# Altium schematic sheet 18650 Charging.SchDoc
size A4
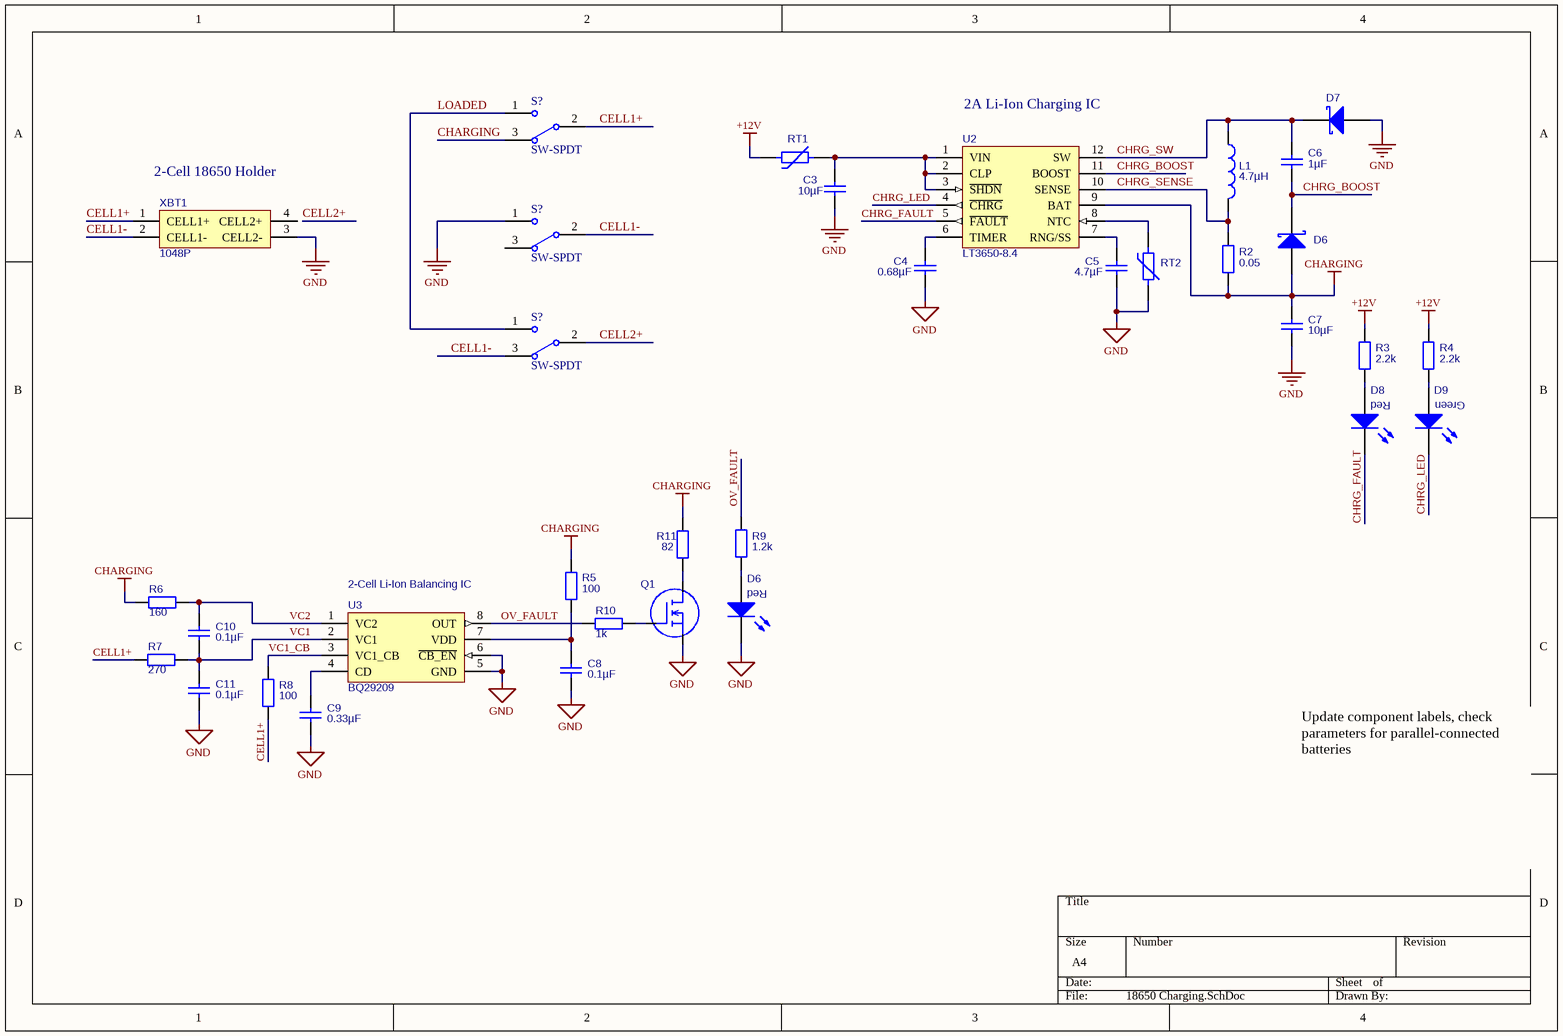
[diagram p0: 18650 Charging.SchDoc]

## Parts
(Parts that share a designator on the sheet are numbered #1, #2 ... from top to bottom, then left to right.)
C3  value 10µF  [TDK C-Series (3216)]
C4  value 0.68µF  [TDK C-Series (1608)]
C5  value 4.7µF  [TDK C-Series (2012)]
C6  value 1µF  [TDK C-Series (1608)]
C7  value 10µF  [TDK C-Series (3216)]
C8  value 0.1µF  [TDK C-Series (1608)]  (hidden comment: Cap)
C9  value 0.33µF  [TDK C-Series (1608)]  (hidden comment: Cap)
C10  value 0.1µF  [TDK C-Series (1608)]  (hidden comment: Cap)
C11  value 0.1µF  [TDK C-Series (1608)]  (hidden comment: Cap)
D6#1  D Schottky  [NXP PMEG6020AELRX (SOD-123)]  (value not drawn)
D6#2  LTST-C193KGKT-5A  [Lite-On LTST-C193K-Series (1608)]  (value not drawn)
D7  D Schottky  [NXP PMEG6020AELRX (SOD-123)]  (value not drawn)
D8  LTST-C193KGKT-5A  [Lite-On LTST-C193K-Series (1608)]  (value not drawn)
D9  LTST-C193KGKT-5A  [Lite-On LTST-C193K-Series (1608)]  (value not drawn)
L1  value 4.7µH  [Bourns SRU8028-Series]  (hidden comment: Inductor)
Q1  NX3020NAKW  [NXP NX3020NAKW (SOT-323)]  (value not drawn)
R2  value 0.05  [Panasonic ERJ-Series (1608)]
R3  value 2.2k  [Panasonic ERJ-Series (1608)]
R4  value 2.2k  [Panasonic ERJ-Series (1608)]
R5  value 100  [Panasonic ERJ-Series (1608)]
R6  value 160  [Panasonic ERJ-Series (1608)]
R7  value 270  [Panasonic ERJ-Series (1608)]
R8  value 100  [Panasonic ERJ-Series (1608)]
R9  value 1.2k  [Panasonic ERJ-Series (1608)]
R10  value 1k  [Panasonic ERJ-Series (1608)]
R11  value 82  [TE 3521-Series (6432)]
RT1  Thermistor  [Bel Fuse 0ZCG-Series (4532)]  (value not drawn)
RT2  Thermistor  [TDK NTCG-Series (1608)]  (value not drawn)
S?#1  SW-SPDT  [TL36WW15050]
S?#2  SW-SPDT  [TL36WW15050]
S?#3  SW-SPDT  [TL36WW15050]
U2  LT3650-8.4  [Linear Technology LT3650-8.4 (12-TSSOP)]
U3  BQ29209  [TI BQ29209 (8-VDFN)]
XBT1  1048P  [KEYSTONE 1048P]

## Nets
+12V: R3.2 R4.2 RT1.1
CHARGING: C7.1 D6#1.1(A) R2.1 R5.1 R6.2 R11.2 S?#1.3 U2.9(BAT)
GND: C3.2 C4.2 C5.2 C7.2 C8.2 C9.2 C11.2 D6#2.2(K) D7.1(A) Q1.2(SOURCE) RT2.2 S?#2.1 U3.5(GND) U3.6(~{CB_EN}) XBT1.3(CELL2-)
CELL1+: R7.2 R8.2 S?#1.2 XBT1.1(CELL1+)
CELL1-: S?#2.2 S?#3.3 XBT1.2(CELL1-)
CELL2+: S?#3.2
CHRG_BOOST: C6.1 D6#1.2(K) U2.11(BOOST)
CHRG_FAULT: D8.2(K) U2.5(~{FAULT})
CHRG_LED: D9.2(K) U2.4(~{CHRG})
CHRG_SENSE: L1.2 R2.2 U2.10(SENSE)
CHRG_SW: C6.2 D7.2(K) L1.1 U2.12(SW)
LOADED: S?#1.1 S?#3.1
OV_FAULT: R9.2 R10.1 U3.8(OUT)
VC1: C10.2 C11.1 R7.1 U3.2(VC1)
VC1_CB: R8.1 U3.3(VC1_CB)
VC2: C10.1 R6.1 U3.1(VC2)
NetC3_1: C3.1 RT1.2 U2.1(VIN) U2.2(CLP) U2.3(~{SHDN})
NetC4_1: C4.1 U2.6(TIMER)
NetC5_1: C5.1 U2.7(RNG/SS)
NetC8_1: C8.1 R5.2 U3.7(VDD)
NetC9_1: C9.1 U3.4(CD)
NetD6#2_1: D6#2.1(A) R9.1
NetD8_1: D8.1(A) R3.1
NetD9_1: D9.1(A) R4.1
NetQ1_1: Q1.1(GATE) R10.2
NetQ1_3: Q1.3(DRAIN) R11.1
NetRT2_1: RT2.1 U2.8(NTC)

Not connected (* = marked no-connect by the designer): S?#2 3; XBT1 4(CELL2+)

## Notes on the sheet
- (near U2) 2A Li-Ion Charging IC
- (near XBT1) 2-Cell 18650 Holder
- (near D8) Red
- (near D9) Green
- (near U3) 2-Cell Li-Ion Balancing IC
- (near D6#2) Red
- Update component labels, check parameters for parallel-connected batteries

## Library data of the parts
C3-C11 = Cap: Capacitor; Published: 8-Jun-2000; LatestRevisionDate: 17-Jul-2002; LatestRevisionNote: Re-released for DXP Platform.; PackageReference: RAD-0.3; Publisher: Altium Limited; PackageDescription: Radial Cap, Thru-Hole; 2 Leads; 0.3 in Pin Spacing; Supplier 1: Digi-Key
  C3 C7: Supplier Part Number 1: 445-7705-1-ND
  C4: Supplier Part Number 1: 445-5129-1-ND
  C5: Supplier Part Number 1: 445-6859-1-ND
  C6: Supplier Part Number 1: 445-5956-1-ND
  C8 C10 C11: Supplier Part Number 1: 445-1316-1-ND
  C9: Supplier Part Number 1: 445-5126-1-ND
D6#1 D7 = D Schottky: Schottky Diode; pin to pad: 1>2 2>1; Published: 8-Jun-2000; LatestRevisionDate: 17-Jul-2002; LatestRevisionNote: Re-released for DXP Platform.; Publisher: Altium Limited; Supplier 1: Digi-Key; Supplier Part Number 1: 568-12710-1-ND
D6#2 D8 D9 = LED0: Typical INFRARED GaAs LED; Published: 8-Jun-2000; LatestRevisionDate: 08-Jul-2005; LatestRevisionNote: Mech Layer 1 removed.; PackageReference: LED-0; Publisher: Altium Limited; PackageDescription: LED; 2 Leads; Supplier 1: Digi-Key
  D6#2 D8: Supplier Part Number 1: 160-1830-1-ND
  D9: Supplier Part Number 1: 160-1828-1-ND
L1 = Inductor: Code_IEC: 1005; Published: 8-Jun-2000; LatestRevisionDate: 29-May-2009; LatestRevisionNote: IPC-7351 Footprint Added.; PackageReference: 0402-A; Publisher: Altium Limited; PackageDescription: Chip Inductor; Code_JEITA: 0402; Supplier 1: Digi-Key; Supplier Part Number 1: SRU8028-4R7YCT-ND
Q1 = NXP NX3020NAKW: 30V 200mA N-MOSFET; Supplier 1: Digi-Key; Supplier Part Number 1: 568-10508-1-ND
R2-R11 = Res2: Resistor; Published: 8-Jun-2000; LatestRevisionDate: 17-Jul-2002; LatestRevisionNote: Re-released for DXP Platform.; PackageReference: AXIAL-0.4; Publisher: Altium Limited; PackageDescription: Axial Device, Thru-Hole; 2 Leads; 0.4 in Pin Spacing; Supplier 1: Digi-Key
  R2: Supplier Part Number 1: P17472CT-ND
  R3 R4: Supplier Part Number 1: P2.20KHCT-ND
  R5 R8: Supplier Part Number 1: P100HCT-ND
  R6: Supplier Part Number 1: P160HCT-ND
  R7: Supplier Part Number 1: P270HCT-ND
  R9: Supplier Part Number 1: P1.20KHCT-ND
  R10: Supplier Part Number 1: P1.00KHCT-ND
  R11: Supplier Part Number 1: A116006CT-ND
S?#1-S?#3 = SW-SPDT: SPDT Subminiature Toggle Switch, Right Angle Mounting, Vertical Actuation; Published: 24-Mar-1999; LatestRevisionDate: 17-Dec-2003; LatestRevisionNote: Schematic revised, PCB Footprint replaced.; DatasheetVersion: 05-Dec-2000; PackageReference: TL36WW15050; Publisher: Altium Limited; PackageDescription: Switch; 4 Leads; ComponentLink1Description: Manufacturer Link; ComponentLink1URL: http://www.apem.com
U2 = Linear Technology LT3650-8.4: 2A 2-Cell Li-Ion Battery Charger; Supplier 1: Digi-Key; Supplier Part Number 1: LT3650EMSE-8.4#PBF-ND
U3 = TI BQ29209: 2-Cell Li-Ion Cell Balancing IC; Supplier 1: Digi-Key; Supplier Part Number 1: 296-27677-1-ND
XBT1 = Keystone 1048P: Dual 18650 Battery Holder; Supplier 1: Digi-Key; Supplier Part Number 1: 36-1048P-ND
RT1 RT2 = Thermistor: Supplier 1: Digi-Key
  RT1: Supplier Part Number 1: 507-1770-1-ND
  RT2: Supplier Part Number 1: 445-2554-1-ND